# Altium project PCB_Project.PrjPcb
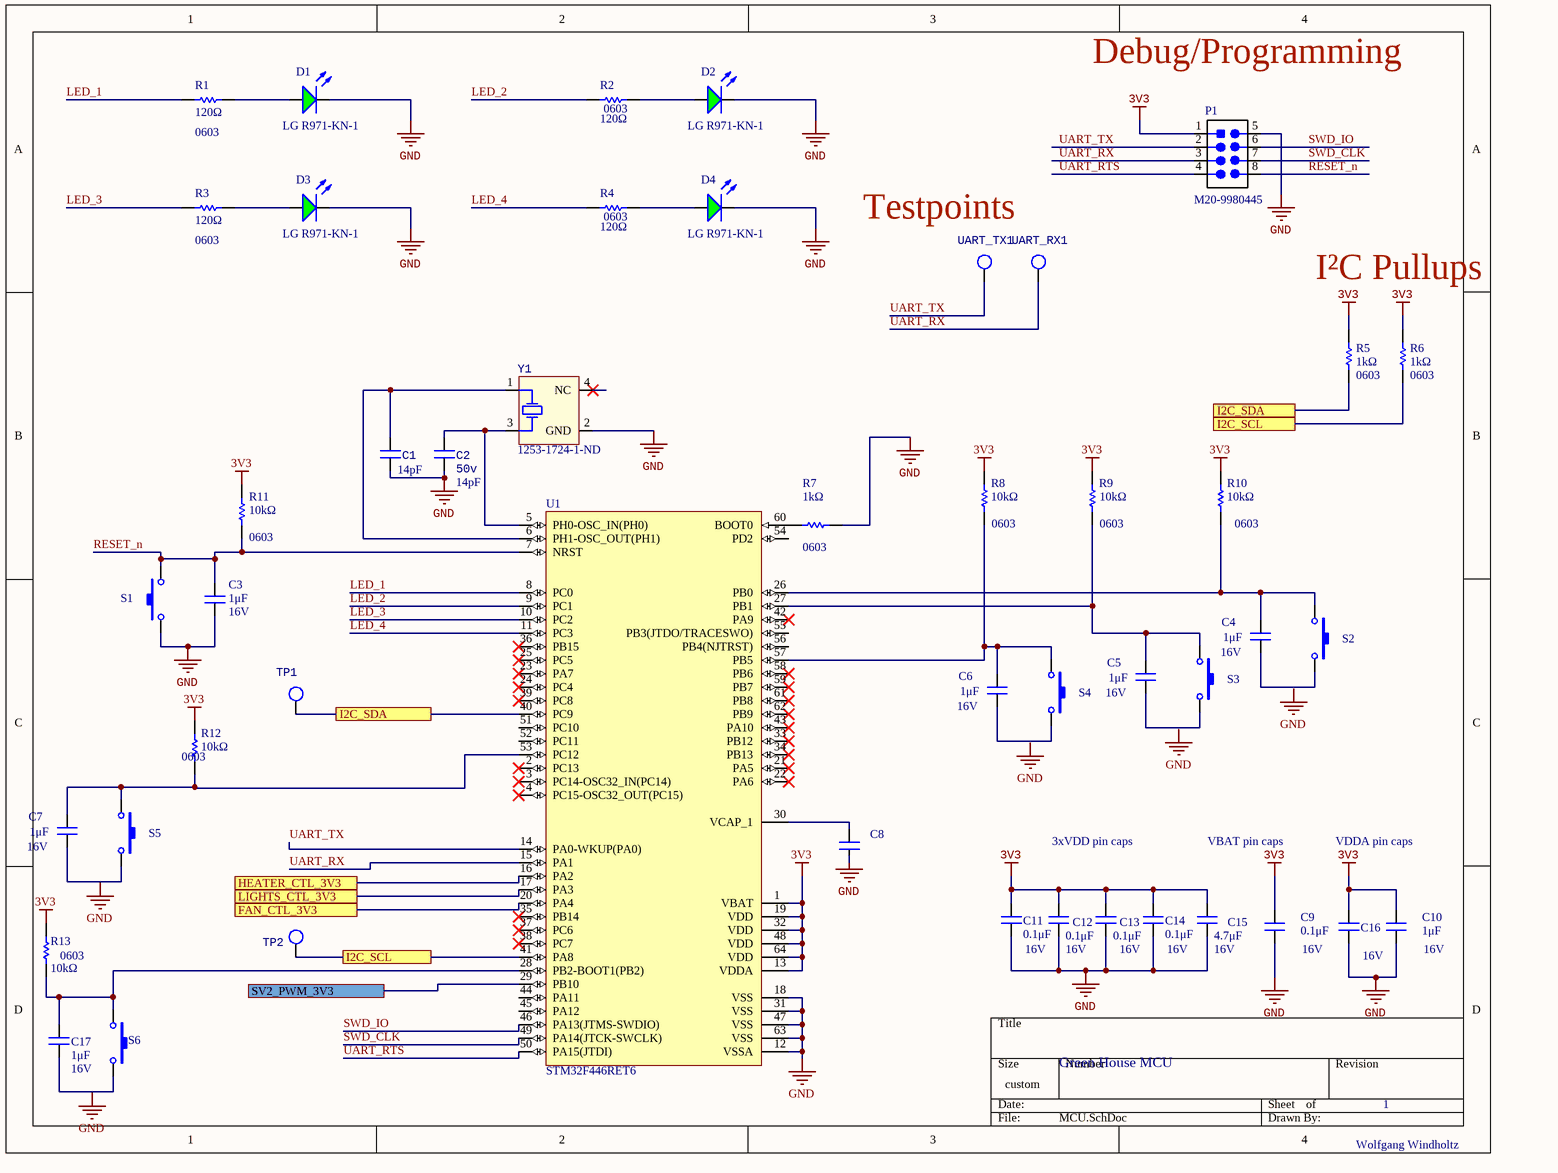
[diagram p0: MCU.SchDoc]
Title: Greenhouse MCU
2 sheets, 60 parts. Net scope: flat (ports and power ports of the same name join across sheets).
Sheets:
  MCU.SchDoc
  peripherals.SchDoc

## Sheet MCU.SchDoc: Greenhouse MCU
size 279 x 215 mm

### Parts
C1  value 14pF  [CAP0603]  (hidden comment: CAP_14pF_50V_0603)
C2  50v  value 14pF  [CAP0603]
C3  value 1μF  Voltage Rating: 16V  [CAP2012]  (hidden comment: CAP_1uF_16V_0805)
C4  value 1μF  Voltage Rating: 16V  [CAP2012]  (hidden comment: CAP_1uF_16V_0805)
C5  value 1μF  Voltage Rating: 16V  [CAP2012]  (hidden comment: CAP_1uF_16V_0805)
C6  value 1μF  Voltage Rating: 16V  [CAP2012]  (hidden comment: CAP_1uF_16V_0805)
C7  value 1μF  Voltage Rating: 16V  [CAP2012]  (hidden comment: CAP_1uF_16V_0805)
C8  CAP_4.7uF_50V_1206  [CAP1206]  (value not drawn)
C9  value 0.1μF  Voltage Rating: 16V  [CAP0603]  (hidden comment: CAP_0.1uF_16V_0603)
C10  value 1μF  Voltage Rating: 16V  [CAP0603]  (hidden comment: CAP_1uF_16V_0603)
C11  value 0.1μF  Voltage Rating: 16V  [CAP0603]  (hidden comment: CAP_0.1uF_16V_0603)
C12  value 0.1μF  Voltage Rating: 16V  [CAP0603]  (hidden comment: CAP_0.1uF_16V_0603)
C13  value 0.1μF  Voltage Rating: 16V  [CAP0603]  (hidden comment: CAP_0.1uF_16V_0603)
C14  value 0.1μF  Voltage Rating: 16V  [CAP0603]  (hidden comment: CAP_0.1uF_16V_0603)
C15  value 4.7μF  Voltage Rating: 16V  [CAP0603]  (hidden comment: CAP_4.7uF_16V_0603)
C16  Voltage Rating: 16V  [CAP2012]  (hidden comment: CAP_10nF_16V_0805)
C17  value 1μF  Voltage Rating: 16V  [CAP2012]  (hidden comment: CAP_1uF_16V_0805)
D1  Manufacturer Part Number 1: LG R971-KN-1  [LED_0805_GREEN]  (hidden comment: LED_GREEN)
D2  Manufacturer Part Number 1: LG R971-KN-1  [LED_0805_GREEN]  (hidden comment: LED_GREEN)
D3  Manufacturer Part Number 1: LG R971-KN-1  [LED_0805_GREEN]  (hidden comment: LED_GREEN)
D4  Manufacturer Part Number 1: LG R971-KN-1  [LED_0805_GREEN]  (hidden comment: LED_GREEN)
P1  Manufacturer Part Number 1: M20-9980445  [HEADER_2X4]  (hidden comment: HEADER 4X2)
R1  value 120Ω  Package/Footprint: 0603  [RESC0603]  (hidden comment: RES_120Ω_0603_5%)
R2  value 120Ω  Package/Footprint: 0603  [RESC0603]  (hidden comment: RES_120Ω_0603_5%)
R3  value 120Ω  Package/Footprint: 0603  [RESC0603]  (hidden comment: RES_120Ω_0603_5%)
R4  value 120Ω  Package/Footprint: 0603  [RESC0603]  (hidden comment: RES_120Ω_0603_5%)
R5  value 1kΩ  Package/Footprint: 0603  [RESC0603]  (hidden comment: RES_1kΩ_0603_5%)
R6  value 1kΩ  Package/Footprint: 0603  [RESC0603]  (hidden comment: RES_1kΩ_0603_5%)
R7  value 1kΩ  Package/Footprint: 0603  [RESC0603]  (hidden comment: RES_1kΩ_0603_5%)
R8  value 10kΩ  Package/Footprint: 0603  [RESC0603]  (hidden comment: RES_10kΩ_0603_5%)
R9  value 10kΩ  Package/Footprint: 0603  [RESC0603]  (hidden comment: RES_10kΩ_0603_5%)
R10  value 10kΩ  Package/Footprint: 0603  [RESC0603]  (hidden comment: RES_10kΩ_0603_5%)
R11  value 10kΩ  Package/Footprint: 0603  [RESC0603]  (hidden comment: RES_10kΩ_0603_5%)
R12  value 10kΩ  Package/Footprint: 0603  [RESC0603]  (hidden comment: RES_10kΩ_0603_5%)
R13  value 10kΩ  Package/Footprint: 0603  [RESC0603]  (hidden comment: RES_10kΩ_0603_5%)
S1  SW_TACTILE  [B3U-1000P]  (value not drawn)
S2  SW_TACTILE  [B3U-1000P]  (value not drawn)
S3  SW_TACTILE  [B3U-1000P]  (value not drawn)
S4  SW_TACTILE  [B3U-1000P]  (value not drawn)
S5  SW_TACTILE  [B3U-1000P]  (value not drawn)
S6  SW_TACTILE  [B3U-1000P]  (value not drawn)
TP1  TESTPOINT_LOOP  [TESTPOINT_LOOP]  (value not drawn)
TP2  TESTPOINT_LOOP  [TESTPOINT_LOOP]  (value not drawn)
U1  STM32F446RET6  [STM-LQFP64_L]
UART_RX1  TESTPOINT_LOOP  [TESTPOINT_LOOP]  (value not drawn)
UART_TX1  TESTPOINT_LOOP  [TESTPOINT_LOOP]  (value not drawn)
Y1  Supplier Part Number 1: 1253-1724-1-ND  [SOIC254P1016X440-4N]  (hidden comment: CRYSTAL_25MHZ)

### Ports
FAN_CTL_3V3, HEATER_CTL_3V3, I2C_SCL, I2C_SDA, LIGHTS_CTL_3V3, SV2_PWM_3V3

### Nets
3V3: C9.2 C10.2 C11.2 C12.2 C13.2 C14.2 C15.2 C16.2 P1.1(VCC) R5.2 R6.2 R8.2 R9.2 R10.2 R11.2 R12.2 R13.2 U1.1(VBAT) U1.13(VDDA) U1.19(VDD) U1.32(VDD) U1.48(VDD) U1.64(VDD)
GND: C1.1 C2.1 C3.1 C8.1 C9.1 C10.1 C11.1 C12.1 C13.1 C14.1 C15.1 C16.1 D1.2(K) D2.2(K) D3.2(K) D4.2(K) P1.5(GND) R7.2 S1.2 U1.12(VSSA) U1.18(VSS) U1.31(VSS) U1.47(VSS) U1.63(VSS) Y1.2(GND)
LED_1: R1.1 U1.8(PC0)
LED_2: R2.1 U1.9(PC1)
LED_3: R3.1 U1.10(PC2)
LED_4: R4.1 U1.11(PC3)
RESET_n: C3.2 P1.8 R11.1 S1.1 U1.7(NRST)
SWD_CLK: P1.7 U1.49(PA14(JTCK-SWCLK))
SWD_IO: P1.6 U1.46(PA13(JTMS-SWDIO))
UART_RTS: P1.4 U1.50(PA15(JTDI))
UART_RX: P1.3 U1.15(PA1) UART_RX1.1
UART_TX: P1.2 U1.14(PA0-WKUP(PA0)) UART_TX1.1
NetC1_2: C1.2 U1.6(PH1-OSC_OUT(PH1)) Y1.1(HOT)
NetC2_2: C2.2 U1.5(PH0-OSC_IN(PH0)) Y1.3(HOT)
NetC4_1: C4.1 S2.2
NetC4_2: C4.2 R10.1 S2.1 U1.26(PB0)
NetC5_1: C5.1 S3.2
NetC5_2: C5.2 R9.1 S3.1 U1.27(PB1)
NetC6_1: C6.1 S4.2
NetC6_2: C6.2 R8.1 S4.1 U1.57(PB5)
NetC7_1: C7.1 S5.2
NetC7_2: C7.2 R12.1 S5.1 U1.53(PC12)
NetC8_2: C8.2 U1.30(VCAP_1)
NetC17_1: C17.1 S6.2
NetC17_2: C17.2 R13.1 S6.1 U1.28(PB2-BOOT1(PB2))
NetD1_1: D1.1(A) R1.2
NetD2_1: D2.1(A) R2.2
NetD3_1: D3.1(A) R3.2
NetD4_1: D4.1(A) R4.2
NetR5_1: R5.1 TP1.1 U1.40(PC9) ; port I2C_SDA
NetR6_1: R6.1 TP2.1 U1.41(PA8) ; port I2C_SCL
NetR7_1: R7.1 U1.60(BOOT0)
NetR14_1: U1.16(PA2) ; port HEATER_CTL_3V3
NetR15_1: U1.17(PA3) ; port LIGHTS_CTL_3V3
NetR16_1: U1.20(PA4) ; port FAN_CTL_3V3
NetU1_29: U1.29(PB10) ; port SV2_PWM_3V3

Not connected (* = marked no-connect by the designer): U1 2(PC13)* 3(PC14-OSC32_IN(PC14))* 4(PC15-OSC32_OUT(PC15))* 21(PA5)* 22(PA6)* 23(PA7)* 24(PC4)* 25(PC5)* 33(PB12)* 34(PB13)* 35(PB14)* 36(PB15)* 37(PC6)* 38(PC7)* 39(PC8)* 42(PA9)* 43(PA10)* 44(PA11) 45(PA12) 51(PC10) 52(PC11) 54(PD2) 55(PB3(JTDO/TRACESWO)) 56(PB4(NJTRST)) 58(PB6)* 59(PB7)* 61(PB8)* 62(PB9)*; Y1 4(NC)*

### Notes on the sheet
- Debug/Programming
- Testpoints
- I²C Pullups
- 3xVDD pin caps
- VBAT pin caps
- VDDA pin caps
- Green House MCU
- 1
- Wolfgang Windholtz
- Labels drawn without touching a wire or pin: GND
- Title
- Size:
- Date:
- File:
- Orcad E
- Number:
- Time:
- Revision:
- Sheet
- of

### Library data of the parts
C1 C2 = CAP_14pF_50V_0603: CAP CER 14PF 50V C0G/NP0 0603; Manufacturer 1: Samsung; Manufacturer Part Number 1: CL10C140JB8NNNC; Dielectric: C0G; Package/Footprint: 0603; Supplier 1: Digi-Key; Voltage Rating: 50V; Supplier Part Number 1: 1276-2187-1-ND; Mounting Type: SMD
C3-C7 C17 = CAP_1uF_16V_0805: CAP CER 1UF 16V X7R 0805; Manufacturer 1: Yageo; Manufacturer Part Number 1: CC0805KKX7R7BB105; Package/Footprint: 0805; Dielectric: X7R; Supplier 1: Digi-Key; Supplier Part Number 1: 311-1365-1-ND; Mounting Type: SMD
C8 = CAP_4.7uF_50V_1206: CAP CER 4.7UF 50V X7R 1206; Manufacturer Part Number 1: GRM31CR71H475KA12L; Manufacturer 1: Murata; Package/Footprint: 1206; Supplier Part Number 1: 490-6521-1-ND; Supplier 1: Digi-Key; Dielectric: X7R; Mounting Type: SMD
C9 C11-C14 = CAP_0.1uF_16V_0603: CAP CER 0.1UF 16V X7R 0603; Manufacturer Part Number 1: CC0603KRX7R7BB104; Manufacturer 1: Yageo; Package/Footprint: 0603; Supplier Part Number 1: 311-1088-1-ND; Supplier 1: Digi-Key; Dielectric: X7R
C10 = CAP_1uF_16V_0603: CAP CER 1UF 16V Y5V 0603; Manufacturer 1: Yageo; Manufacturer Part Number 1: CC0603ZRY5V7BB105; Package/Footprint: 0603; Supplier Part Number 1: 311-1372-1-ND; Supplier 1: Digi-Key; Dielectric: Y5V; Mounting Type: SMD
C15 = CAP_4.7uF_16V_0603: CAP CER 4.7UF 16V X6S 0603; Manufacturer Part Number 1: GRM188C81C475KE11D; Manufacturer 1: Murata Electronics; Package/Footprint: 0603; Supplier Part Number 1: 490-13362-1-ND; Supplier 1: Digi-Key; Dielectric: X6S; Mounting Type: SMD
C16 = CAP_10nF_16V_0805: CAP CER 10000PF 16V X7R 0805; Manufacturer Part Number 1: AC0805KRX7R7BB103; Manufacturer 1: Yageo; Supplier Part Number 1: 311-3161-1-ND; Supplier 1: Digi-Key
D1-D4 = LED_GREEN: LED GREEN DIFFUSED 0805 SMD; Manufacturer 1: OSRAM; Forward Voltage Drop: 2.2V; Package/Footprint: 0805; Supplier Part Number 1: 475-1410-1-ND; Supplier 1: Digi-Key; Mounting Type: SMD
P1 = HEADER 4X2: CONN HEADER VERT 8POS 2.54MM; Manufacturer 1: Harwin Inc.; Supplier Part Number 1: 952-2122-ND; Supplier 1: Digi-Key
R1-R4 = RES_120Ω_0603_5%: RES 120 OHM 5% 1/10W 0603; Manufacturer 1: Yageo; Manufacturer Part Number 1: RC0603JR-07120RL; Supplier Part Number 1: 311-120GRCT-ND; Supplier 1: Digi-Key; Mounting Type: SMD
R5-R7 = RES_1kΩ_0603_5%: RES 1K OHM 5% 1/10W 0603; Manufacturer 1: Yageo; Manufacturer Part Number 1: RC0603JR-071KL; Supplier Part Number 1: 311-1.0KGRCT-ND; Supplier 1: Digi-Key; Mounting Type: SMD
R8-R13 = RES_10kΩ_0603_5%: RES 10K OHM 5% 1/10W 0603; Manufacturer 1: Yageo; Manufacturer Part Number 1: RC0603JR-0710KL; Supplier 1: Digi-Key; Supplier Part Number 1: 311-10KGRCT-ND; Mounting Type: SMD
S1-S6 = SW_TACTILE: Tactile Switch (Grey); Manufacturer 1: Omron Electronics Inc-EMC Div; Manufacturer Part Number 1: B3U-1000P; Supplier 1: Digi-Key; Supplier Part Number 1: SW1020CT-ND; Mount: Surface Mount
TP1 TP2 UART_RX1 UART_TX1 = TESTPOINT_LOOP: TESTPOINT THRUHOLE; Manufacturer Part Number 1: 5002; Manufacturer 1: Keystone Electronics; Package/Footprint: TH; Supplier Part Number 1: 36-5002-ND; Supplier 1: Digi-Key; Mounting Type: TH
U1 = MCU_STM32F446RET6: ARM Cortex-M4 32-bit MCU+FPU, 512 KB Flash, 128 KB Internal RAM, 50 I/Os, 64-Pin LQFP, -40 to 85 degC, Tray; I/Os (High Current): 50; Supply Voltage(Vcc) min (V): 1.7; Operating Frequency(F) (Processor speed) (MHz): 180; D/A Converter: 2; Internal RAM Size (kB): 128; FLASH Size (Prog) (kB): 512; Core: ARM Cortex-M4; ComponentLink1Description: Manufacturer URL; Package Reference: 64-Pin Low-profile Quad Flat Package, Body 10 x 10 mm, Pitch 0.5 mm; ComponentLink2URL: http://www.st.com/st-web-ui/static/active/en/resource/technical/document/datasheet/DM00141306.pdf; Packing: Tray; DatasheetVersion: Rev. 6; ComponentLink1URL: http://www.st.com/; ComponentLink2Description: Datasheet; Package Description: LQFP64; Mounting Technology: Surface Mount; Supplier 1: Digi-Key; Supplier Part Number 1: 497-15376-ND
Y1 = CRYSTAL_25MHZ: CRYSTAL 25.0000MHZ 12PF SMD; Manufacturer 1: Kyocera AVX; Manufacturer Part Number 1: CX2520DB25000H0FLJC1; Frequency: 25MHz; Load Capacitance: 12pF; Supplier 1: Digi-Key; Mounting Type: SMD; Package/Footprint: SMD

## Sheet peripherals.SchDoc: Greenhouse MCU
size A
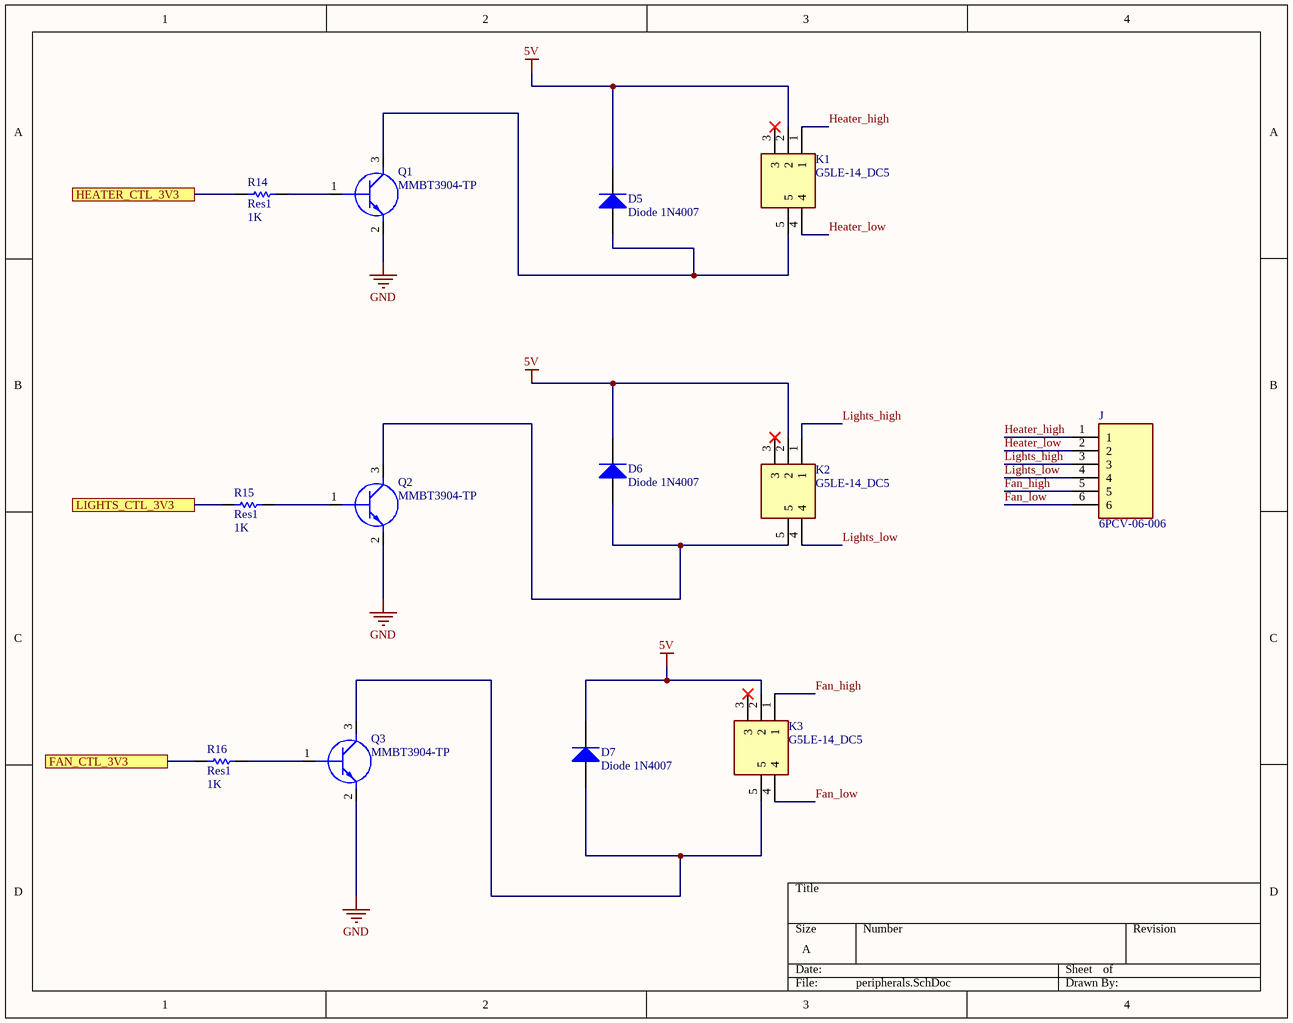
[diagram p1: peripherals.SchDoc]

### Parts
D5  Diode 1N4007  [DO-41]
D6  Diode 1N4007  [DO-41]
D7  Diode 1N4007  [DO-41]
J  6PCV-06-006  [TE_9-1437652-5]
K1  G5LE-14_DC5  [G5LE-1A]
K2  G5LE-14_DC5  [G5LE-1A]
K3  G5LE-14_DC5  [G5LE-1A]
Q1  MMBT3904-TP  [SI2305TP]
Q2  MMBT3904-TP  [SI2305TP]
Q3  MMBT3904-TP  [SI2305TP]
R14  Res1  value 1K  [AXIAL-0.3]
R15  Res1  value 1K  [AXIAL-0.3]
R16  Res1  value 1K  [AXIAL-0.3]

### Ports
FAN_CTL_3V3, HEATER_CTL_3V3, LIGHTS_CTL_3V3

### Nets
5V: D5.2(K) D6.2(K) D7.2(K) K1.2 K2.2 K3.2
GND: Q1.2(E) Q2.2(E) Q3.2(E)
Fan_high: J.5 K3.1
Fan_low: J.6 K3.4
Heater_high: J.1 K1.1
Heater_low: J.2 K1.4
Lights_high: J.3 K2.1
Lights_low: J.4 K2.4
NetD5_1: D5.1(A) K1.5 Q1.3(C)
NetD6_1: D6.1(A) K2.5 Q2.3(C)
NetD7_1: D7.1(A) K3.5 Q3.3(C)
NetQ1_1: Q1.1(B) R14.2
NetQ2_1: Q2.1(B) R15.2
NetQ3_1: Q3.1(B) R16.2
NetR14_1: R14.1 ; port HEATER_CTL_3V3
NetR15_1: R15.1 ; port LIGHTS_CTL_3V3
NetR16_1: R16.1 ; port FAN_CTL_3V3

Not connected (* = marked no-connect by the designer): K1 3*; K2 3*; K3 3*

### Library data of the parts
D5-D7 = Diode 1N4007: 1 Amp General Purpose Rectifier; Published: 8-Jun-2000; LatestRevisionDate: 17-Jul-2002; LatestRevisionNote: Re-released for DXP Platform.; DatasheetVersion: 1998; PackageVersion: Aug-1999; PackageReference: DO-41; Publisher: Altium Limited; PackageDescription: Diode, Axial; Body 5.2 x 2.7 mm (LxDia. max), Lead Dia. 0.86 mm (max); Code_JEDEC: DO-204-AL; ComponentLink1Description: Manufacturer Link; ComponentLink1URL: http://www.fairchildsemi.com/; ComponentLink2Description: Datasheet; ComponentLink2URL: http://www.fairchildsemi.com/ds/1N%2F1N4001.pdf
J = 6PCV-06-006: Buchanan 6 Position 9.53 mm Pitch Single Row 12-22 AWG Tri-Barrier Strip; MF: TE Connectivity; MP: 6PCV-06-006; Value: *; TE_purchase_URL: https://www.te.com/usa-en/product-9-1437652-5.html?te_bu=Cor&te_type=disp&te_campaign=seda_glo_cor-seda-global-disp-prtnr-fy19-seda-model-bom-cta_sma-317_1&elqCampaignId=32493; SnapEDA_Link: https://www.snapeda.com/parts/6PCV-06-006/TE%20Connectivity%20AMP%20Connectors/view-part/2782422/?ref=snap; Price: None; Package: None; Availability: Unavailable
K1-K3 = G5LE-14_DC5: Relay or Contactor; Manufacturer_Name: Omron Electronics; Manufacturer_Part_Number: G5LE-14 DC5; Datasheet Link: http://omronfs.omron.com/en_US/ecb/products/pdf/en-g5le.pdf
Q1-Q3 = MMBT3904-TP: Transistor BJT NPN; Manufacturer_Name: Micro Commercial Components (MCC); Datasheet Link: https://componentsearchengine.com/Datasheets/1/MMBT3904-TP.pdf; Manufacturer_Part_Number: MMBT3904-TP; Mouser Part Number: 833-MMBT3904-TP; Mouser Price/Stock: https://www.mouser.co.uk/ProductDetail/Micro-Commercial-Components-MCC/MMBT3904-TP/?qs=KFo7JewZbUHicjDjIayULQ%3D%3D; Arrow Part Number: MMBT3904-TP; Arrow Price/Stock: https://www.arrow.com/en/products/mmbt3904-tp/micro-commercial-components
R14-R16 = Res1: Resistor; Published: 8-Jun-2000; LatestRevisionDate: 17-Jul-2002; LatestRevisionNote: Re-released for DXP Platform.; PackageReference: AXIAL-0.3; Publisher: Altium Limited; PackageDescription: Axial Device, Thru-Hole; 2 Leads; 0.3 in Pin Spacing

## Nets that join several sheets
GND: MCU (25 pins), peripherals (Q1.2 Q2.2 Q3.2)
NetR14_1: MCU (U1.16), peripherals (R14.1)
NetR15_1: MCU (U1.17), peripherals (R15.1)
NetR16_1: MCU (U1.20), peripherals (R16.1)